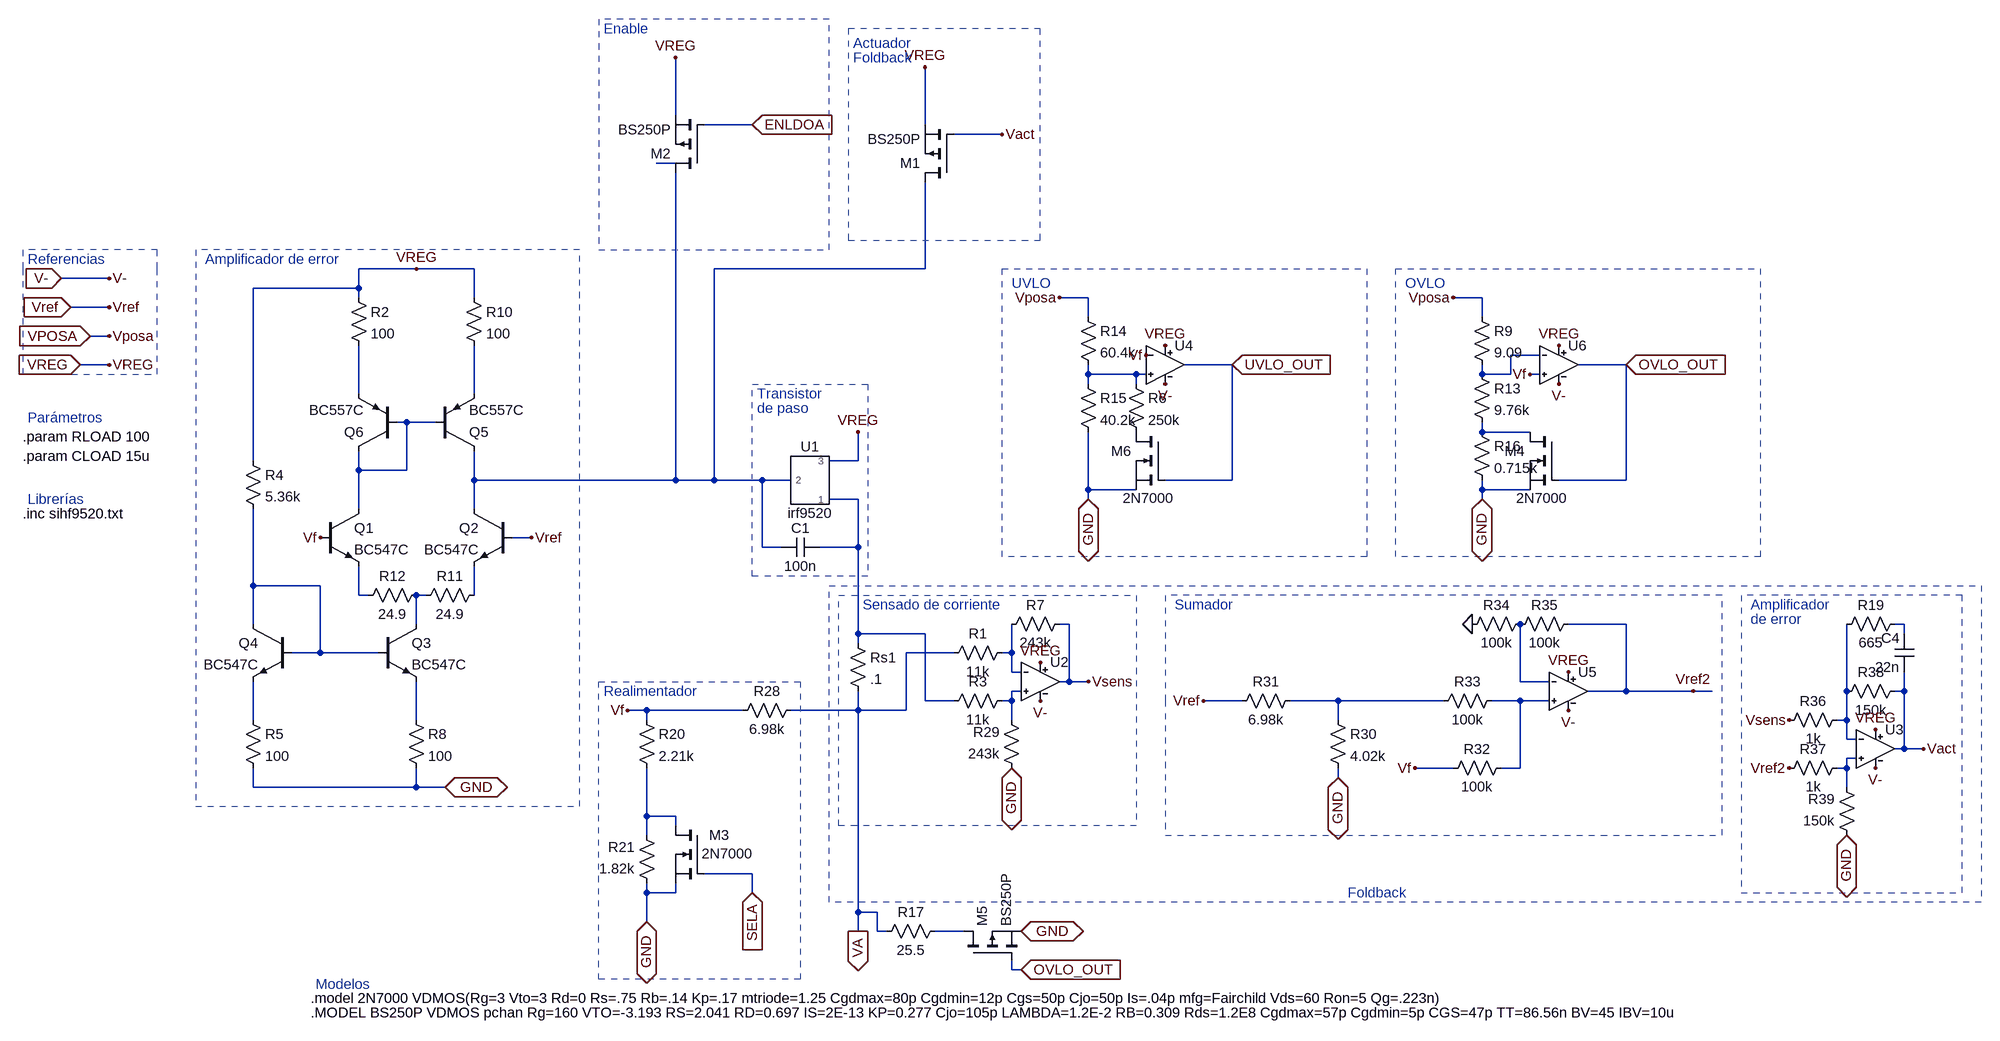
[diagram p0: schematic LDOA.asc]
LDOA.asc, the LTspice schematic file:
Version 4
SHEET 1 26844 1652
WIRE 288 -704 288 -800
WIRE 416 -688 336 -688
WIRE 704 -688 704 -784
WIRE 832 -672 752 -672
WIRE 288 -624 256 -624
WIRE -144 -448 -240 -448
WIRE -48 -448 -144 -448
WIRE 704 -448 704 -592
WIRE 704 -448 352 -448
WIRE -656 -432 -736 -432
WIRE -240 -416 -240 -448
WIRE -240 -416 -416 -416
WIRE -240 -400 -240 -416
WIRE -48 -400 -48 -448
WIRE 976 -400 928 -400
WIRE 1632 -400 1584 -400
WIRE -656 -384 -720 -384
WIRE 976 -368 976 -400
WIRE 1632 -368 1632 -400
WIRE -656 -336 -688 -336
WIRE 1728 -304 1680 -304
WIRE -656 -288 -704 -288
WIRE 1216 -288 1136 -288
WIRE 1872 -288 1792 -288
WIRE 976 -272 976 -288
WIRE 1056 -272 976 -272
WIRE 1072 -272 1056 -272
WIRE 1632 -272 1632 -288
WIRE 1680 -272 1680 -304
WIRE 1680 -272 1632 -272
WIRE 1728 -272 1712 -272
WIRE 976 -256 976 -272
WIRE 1056 -256 1056 -272
WIRE -240 -240 -240 -320
WIRE -48 -240 -48 -320
WIRE -160 -192 -176 -192
WIRE -112 -192 -160 -192
WIRE 1632 -176 1632 -192
WIRE 1712 -176 1632 -176
WIRE -416 -128 -416 -416
WIRE 592 -128 592 -176
WIRE 592 -128 544 -128
WIRE -240 -112 -240 -144
WIRE -160 -112 -160 -192
WIRE -160 -112 -240 -112
WIRE -48 -96 -48 -144
WIRE 288 -96 288 -608
WIRE 288 -96 -48 -96
WIRE 352 -96 352 -448
WIRE 352 -96 288 -96
WIRE 432 -96 352 -96
WIRE 480 -96 432 -96
WIRE 1216 -96 1216 -288
WIRE 1216 -96 1104 -96
WIRE 1872 -96 1872 -288
WIRE 1872 -96 1760 -96
WIRE 976 -80 976 -176
WIRE 1056 -80 976 -80
WIRE 1632 -80 1632 -96
WIRE 1712 -80 1632 -80
WIRE 592 -64 544 -64
WIRE 976 -64 976 -80
WIRE 1632 -64 1632 -80
WIRE -240 -48 -240 -112
WIRE -48 -48 -48 -96
WIRE 48 0 16 0
WIRE 432 16 432 -96
WIRE 464 16 432 16
WIRE 592 16 592 -64
WIRE 592 16 528 16
WIRE -416 80 -416 -48
WIRE -304 80 -416 80
WIRE -240 96 -240 48
WIRE -224 96 -240 96
WIRE -128 96 -144 96
WIRE -48 96 -48 48
WIRE -416 144 -416 80
WIRE -144 144 -144 96
WIRE 944 144 928 144
WIRE 1872 144 1776 144
WIRE 2336 144 2320 144
WIRE 592 160 592 16
WIRE 704 160 592 160
WIRE 2336 160 2336 144
WIRE 592 176 592 160
WIRE -304 192 -304 80
WIRE -304 192 -352 192
WIRE -208 192 -304 192
WIRE 752 192 672 192
WIRE 848 192 848 144
WIRE 848 192 832 192
WIRE 848 224 848 192
WIRE 864 224 848 224
WIRE 944 240 944 144
WIRE 944 240 928 240
WIRE 976 240 944 240
WIRE 1696 240 1696 144
WIRE 1744 240 1696 240
WIRE 864 256 848 256
WIRE 1872 256 1872 144
WIRE 1872 256 1808 256
WIRE 1984 256 1872 256
WIRE 2016 256 1984 256
WIRE 2240 256 2240 144
WIRE 2336 256 2336 224
WIRE 2336 256 2320 256
WIRE 704 272 704 160
WIRE 752 272 704 272
WIRE 848 272 848 256
WIRE 848 272 832 272
WIRE 1232 272 1168 272
WIRE 1392 272 1312 272
WIRE 1568 272 1392 272
WIRE 1696 272 1648 272
WIRE 1744 272 1696 272
WIRE 240 288 208 288
WIRE 400 288 240 288
WIRE 592 288 592 256
WIRE 592 288 480 288
WIRE 672 288 672 192
WIRE 672 288 592 288
WIRE -416 304 -416 240
WIRE -144 304 -144 240
WIRE 240 304 240 288
WIRE 848 304 848 272
WIRE 1392 304 1392 272
WIRE 2240 304 2240 256
WIRE 2240 304 2224 304
WIRE 2240 336 2240 304
WIRE 2256 336 2240 336
WIRE 2336 352 2336 256
WIRE 2336 352 2320 352
WIRE 2368 352 2336 352
WIRE 2256 368 2240 368
WIRE 1584 384 1520 384
WIRE 1696 384 1696 272
WIRE 1696 384 1664 384
WIRE 2240 384 2240 368
WIRE 2240 384 2224 384
WIRE 1392 400 1392 384
WIRE -416 416 -416 384
WIRE -144 416 -144 384
WIRE -144 416 -416 416
WIRE -96 416 -144 416
WIRE 2240 416 2240 384
WIRE 240 464 240 384
WIRE 288 464 240 464
WIRE 288 480 288 464
WIRE 240 496 240 464
WIRE 416 560 336 560
WIRE 240 592 240 576
WIRE 288 592 288 576
WIRE 288 592 240 592
WIRE 416 592 416 560
WIRE 592 624 592 288
WIRE 624 624 592 624
WIRE 240 640 240 592
WIRE 592 656 592 624
WIRE 624 656 624 624
WIRE 640 656 624 656
WIRE 768 656 720 656
WIRE 848 720 848 704
WIRE 864 720 848 720
FLAG 704 -784 VREG
FLAG 832 -672 Vact
FLAG 976 240 Vsens
FLAG 1984 256 Vref2
FLAG 1168 272 Vref
FLAG 1520 384 Vf
FLAG 1616 144 0
FLAG 2368 352 Vact
FLAG 2144 384 Vref2
FLAG 2144 304 Vsens
FLAG 208 288 Vf
FLAG -144 -448 VREG
FLAG -304 0 Vf
FLAG 896 208 VREG
FLAG -656 -432 V-
FLAG 896 272 V-
FLAG 2288 320 VREG
FLAG 2288 384 V-
FLAG 1776 224 VREG
FLAG 1776 288 V-
FLAG 288 -800 VREG
FLAG 416 -688 ENLDOA
IOPIN 416 -688 In
FLAG -704 -288 VREG
IOPIN -704 -288 In
FLAG -736 -432 V-
IOPIN -736 -432 In
FLAG -720 -384 Vref
IOPIN -720 -384 In
FLAG 592 656 VA
IOPIN 592 656 Out
FLAG 416 592 SELA
IOPIN 416 592 In
FLAG 240 640 GND
IOPIN 240 640 BiDir
FLAG 848 384 GND
IOPIN 848 384 BiDir
FLAG 1392 400 GND
IOPIN 1392 400 BiDir
FLAG 2240 496 GND
IOPIN 2240 496 BiDir
FLAG -96 416 GND
IOPIN -96 416 BiDir
FLAG -688 -336 VPOSA
IOPIN -688 -336 In
FLAG -656 -336 Vposa
FLAG -656 -384 Vref
FLAG 48 0 Vref
FLAG -656 -288 VREG
FLAG 592 -176 VREG
FLAG 1104 -320 VREG
FLAG 928 -400 Vposa
FLAG 976 -64 GND
IOPIN 976 -64 BiDir
FLAG 1216 -288 UVLO_OUT
IOPIN 1216 -288 In
FLAG 1104 -256 V-
FLAG 1072 -304 Vf
FLAG 1760 -320 VREG
FLAG 1584 -400 Vposa
FLAG 1632 -64 GND
IOPIN 1632 -64 BiDir
FLAG 1872 -288 OVLO_OUT
IOPIN 1872 -288 In
FLAG 1760 -256 V-
FLAG 1712 -272 Vf
FLAG 864 720 OVLO_OUT
IOPIN 864 720 In
FLAG 864 656 GND
IOPIN 864 656 BiDir
SYMBOL pmos 752 -592 R180
SYMATTR InstName M1
SYMATTR Value BS250P
SYMBOL cap 528 0 R90
WINDOW 0 0 32 VBottom 2
WINDOW 3 32 32 VTop 2
SYMATTR InstName C1
SYMATTR Value 100n
SYMBOL res 2224 160 R270
WINDOW 0 32 56 VTop 2
WINDOW 3 0 56 VBottom 2
SYMATTR InstName R19
SYMATTR Value 665
SYMBOL cap 2352 224 R180
WINDOW 0 24 56 Left 2
WINDOW 3 24 8 Left 2
SYMATTR InstName C4
SYMATTR Value 22n
SYMBOL res 224 288 R0
SYMATTR InstName R20
SYMATTR Value 2.21k
SYMBOL res 256 592 R180
WINDOW 0 36 76 Left 2
WINDOW 3 36 40 Left 2
SYMATTR InstName R21
SYMATTR Value 1.82k
SYMBOL res 496 272 R90
WINDOW 0 0 56 VBottom 2
WINDOW 3 32 56 VTop 2
SYMATTR InstName R28
SYMATTR Value 6.98k
SYMBOL nmos 336 480 M0
WINDOW 0 -42 16 Left 2
WINDOW 3 -80 47 Left 2
SYMATTR InstName M3
SYMATTR Value 2N7000
SYMBOL res 576 160 R0
SYMATTR InstName Rs1
SYMATTR Value .1
SYMBOL res 848 176 R90
WINDOW 0 0 56 VBottom 2
WINDOW 3 32 56 VTop 2
SYMATTR InstName R1
SYMATTR Value 11k
SYMBOL res 848 256 R90
WINDOW 0 0 56 VBottom 2
WINDOW 3 32 56 VTop 2
SYMATTR InstName R3
SYMATTR Value 11k
SYMBOL res 944 128 R90
WINDOW 0 0 56 VBottom 2
WINDOW 3 32 56 VTop 2
SYMATTR InstName R7
SYMATTR Value 243k
SYMBOL res 864 400 R180
WINDOW 0 36 76 Left 2
WINDOW 3 36 40 Left 2
SYMATTR InstName R29
SYMATTR Value 243k
SYMBOL res 1376 288 R0
SYMATTR InstName R30
SYMATTR Value 4.02k
SYMBOL res 1328 256 R90
WINDOW 0 0 56 VBottom 2
WINDOW 3 32 56 VTop 2
SYMATTR InstName R31
SYMATTR Value 6.98k
SYMBOL res 1680 368 R90
WINDOW 0 0 56 VBottom 2
WINDOW 3 32 56 VTop 2
SYMATTR InstName R32
SYMATTR Value 100k
SYMBOL res 1664 256 R90
WINDOW 0 0 56 VBottom 2
WINDOW 3 32 56 VTop 2
SYMATTR InstName R33
SYMATTR Value 100k
SYMBOL res 1712 128 R90
WINDOW 0 0 56 VBottom 2
WINDOW 3 32 56 VTop 2
SYMATTR InstName R34
SYMATTR Value 100k
SYMBOL res 1792 128 R90
WINDOW 0 0 56 VBottom 2
WINDOW 3 32 56 VTop 2
SYMATTR InstName R35
SYMATTR Value 100k
SYMBOL res 2240 288 R90
WINDOW 0 0 56 VBottom 2
WINDOW 3 32 56 VTop 2
SYMATTR InstName R36
SYMATTR Value 1k
SYMBOL res 2240 368 R90
WINDOW 0 0 56 VBottom 2
WINDOW 3 32 56 VTop 2
SYMATTR InstName R37
SYMATTR Value 1k
SYMBOL res 2336 240 R90
WINDOW 0 0 56 VBottom 2
WINDOW 3 32 56 VTop 2
SYMATTR InstName R38
SYMATTR Value 150k
SYMBOL res 2256 512 R180
WINDOW 0 36 76 Left 2
WINDOW 3 36 40 Left 2
SYMATTR InstName R39
SYMATTR Value 150k
SYMBOL npn -304 -48 R0
SYMATTR InstName Q1
SYMATTR Value BC547C
SYMBOL npn 16 -48 M0
SYMATTR InstName Q2
SYMATTR Value BC547C
SYMBOL res -256 -416 R0
SYMATTR InstName R2
SYMATTR Value 100
SYMBOL npn -208 144 R0
SYMATTR InstName Q3
SYMATTR Value BC547C
SYMBOL npn -352 144 M0
SYMATTR InstName Q4
SYMATTR Value BC547C
SYMBOL res -432 -144 R0
SYMATTR InstName R4
SYMATTR Value 5.36k
SYMBOL res -432 288 R0
SYMATTR InstName R5
SYMATTR Value 100
SYMBOL res -160 288 R0
SYMATTR InstName R8
SYMATTR Value 100
SYMBOL res -64 -416 R0
SYMATTR InstName R10
SYMATTR Value 100
SYMBOL pnp -112 -144 M180
SYMATTR InstName Q5
SYMATTR Value BC557C
SYMBOL pnp -176 -144 R180
SYMATTR InstName Q6
SYMATTR Value BC557C
SYMBOL res -32 80 R90
WINDOW 0 0 56 VBottom 2
WINDOW 3 32 56 VTop 2
SYMATTR InstName R11
SYMATTR Value 24.9
SYMBOL res -128 80 R90
WINDOW 0 0 56 VBottom 2
WINDOW 3 32 56 VTop 2
SYMATTR InstName R12
SYMATTR Value 24.9
SYMBOL TL081 896 240 R0
SYMATTR InstName U2
SYMBOL TL081 2288 352 R0
SYMATTR InstName U3
SYMBOL TL081 1776 256 R0
SYMATTR InstName U5
SYMBOL pmos 336 -608 R180
SYMATTR InstName M2
SYMATTR Value BS250P
SYMBOL res 960 -384 R0
SYMATTR InstName R14
SYMATTR Value 60.4k
SYMBOL res 960 -272 R0
SYMATTR InstName R15
SYMATTR Value 40.2k
SYMBOL nmos 1104 -176 M0
WINDOW 3 -14 110 Left 2
SYMATTR Value 2N7000
SYMATTR InstName M6
SYMBOL TL081 1104 -288 R0
SYMATTR InstName U4
SYMBOL res 1040 -272 R0
SYMATTR InstName R6
SYMATTR Value 250k
SYMBOL res 1616 -384 R0
SYMATTR InstName R9
SYMATTR Value 9.09
SYMBOL res 1616 -288 R0
SYMATTR InstName R13
SYMATTR Value 9.76k
SYMBOL nmos 1760 -176 M0
WINDOW 3 -14 110 Left 2
SYMATTR Value 2N7000
SYMATTR InstName M4
SYMBOL TL081 1760 -288 R0
SYMATTR InstName U6
SYMBOL res 1616 -192 R0
SYMATTR InstName R16
SYMATTR Value 0.715k
SYMBOL res 736 640 R90
WINDOW 0 0 56 VBottom 2
WINDOW 3 32 56 VTop 2
SYMATTR InstName R17
SYMATTR Value 25.5
SYMBOL pmos 768 704 R270
SYMATTR InstName M5
SYMATTR Value BS250P
SYMBOL irf9520 512 -96 R0
SYMATTR InstName U1
TEXT -800 -168 Left 2 !.param RLOAD 100
TEXT -800 -40 Left 2 !.inc sihf9520.txt
TEXT -320 768 Left 2 !.model 2N7000 VDMOS(Rg=3 Vto=3 Rd=0 Rs=.75 Rb=.14 Kp=.17 mtriode=1.25 Cgdmax=80p Cgdmin=12p Cgs=50p Cjo=50p Is=.04p mfg=Fairchild Vds=60 Ron=5 Qg=.223n)
TEXT -800 -136 Left 2 !.param CLOAD 15u
TEXT -792 -464 Left 2 ;Referencias
TEXT -496 -464 Left 2 ;Amplificador de error
TEXT 168 -848 Left 2 ;Enable
TEXT 584 -824 Left 2 ;Actuador
TEXT 424 -240 Left 2 ;Transistor
TEXT 424 -216 Left 2 ;de paso
TEXT 168 256 Left 2 ;Realimentador
TEXT 600 112 Left 2 ;Sensado de corriente
TEXT 1120 112 Left 2 ;Sumador
TEXT 2080 112 Left 2 ;Amplificador
TEXT 2080 136 Left 2 ;de error
TEXT -312 744 Left 2 ;Modelos
TEXT -792 -200 Left 2 ;Parámetros
TEXT -792 -64 Left 2 ;Librerías
TEXT 1408 592 Left 2 ;Foldback
TEXT 584 -800 Left 2 ;Foldback
TEXT 848 -424 Left 2 ;UVLO
TEXT 1504 -424 Left 2 ;OVLO
TEXT -320 792 Left 2 !.MODEL BS250P VDMOS pchan Rg=160 VTO=-3.193 RS=2.041 RD=0.697 IS=2E-13 KP=0.277 Cjo=105p LAMBDA=1.2E-2 RB=0.309 Rds=1.2E8 Cgdmax=57p Cgdmin=5p CGS=47p TT=86.56n BV=45 IBV=10u
LINE Normal -576 -480 -800 -480 2
LINE Normal -576 -272 -576 -448 2
LINE Normal -800 -272 -576 -272 2
LINE Normal -800 -448 -800 -272 2
LINE Normal 128 -480 -512 -480 3
LINE Normal 128 448 128 -480 3
LINE Normal -512 448 128 448 3
LINE Normal -512 -480 -512 448 3
LINE Normal 160 -864 160 -480 1
LINE Normal 544 -864 160 -864 1
LINE Normal 544 -480 544 -864 1
LINE Normal 160 -480 544 -480 1
LINE Normal 896 -848 576 -848 1
LINE Normal 896 -496 896 -848 1
LINE Normal 576 -496 896 -496 1
LINE Normal 576 -848 576 -496 1
LINE Normal -800 -480 -800 -448 2
LINE Normal -576 -448 -576 -480 2
LINE Normal 608 64 416 64 1
LINE Normal 608 -256 608 64 1
LINE Normal 416 -256 608 -256 1
LINE Normal 416 64 416 -256 1
LINE Normal 160 240 496 240 1
LINE Normal 160 736 160 240 1
LINE Normal 496 736 160 736 1
LINE Normal 496 240 496 736 1
LINE Normal 560 96 896 96 1
LINE Normal 560 480 560 96 1
LINE Normal 1056 480 560 480 1
LINE Normal 1056 96 1056 480 1
LINE Normal 896 96 1056 96 1
LINE Normal 1104 96 1104 272 1
LINE Normal 2032 96 1104 96 1
LINE Normal 2032 496 2032 96 1
LINE Normal 1104 496 2032 496 1
LINE Normal 1104 272 1104 496 1
LINE Normal 2064 96 2064 304 3
LINE Normal 2432 96 2064 96 3
LINE Normal 2432 592 2432 96 3
LINE Normal 2064 592 2432 592 3
LINE Normal 2064 304 2064 592 3
LINE Normal 544 608 544 80 4
LINE Normal 2464 608 544 608 4
LINE Normal 2464 80 2464 608 4
LINE Normal 544 80 2464 80 4
LINE Normal 832 32 832 -448 1
LINE Normal 1440 32 832 32 1
LINE Normal 1440 -448 1440 32 1
LINE Normal 832 -448 1440 -448 1
LINE Normal 1488 32 1488 -448 1
LINE Normal 2096 32 1488 32 1
LINE Normal 2096 -448 2096 32 1
LINE Normal 1488 -448 2096 -448 1

The netlist it stands for:
* LDOA.asc
M1 N002 Vact VREG VREG BS250P
C1 N009 N002 100n
R19 N018 N014 665
C4 Vact N014 22n
R20 Vf N024 2.21k
R21 GND N024 1.82k
R28 VA Vf 6.98k
M3 N024 SELA GND GND 2N7000
Rs1 N009 VA .1
R1 N015 VA 11k
R3 N017 N009 11k
R7 Vsens N015 243k
R29 GND N017 243k
R30 N019 GND 4.02k
R31 N019 Vref 6.98k
R32 N020 Vf 100k
R33 N020 N019 100k
R34 N016 0 100k
R35 Vref2 N016 100k
R36 N018 Vsens 1k
R37 N023 Vref2 1k
R38 Vact N018 150k
R39 GND N023 150k
Q1 N007 Vf N011 0 BC547C
Q2 N002 Vref N013 0 BC547C
R2 VREG N005 100
Q3 N012 N010 N022 0 BC547C
Q4 N010 N010 N021 0 BC547C
R4 VREG N010 5.36k
R5 N021 GND 100
R8 N022 GND 100
R10 VREG N006 100
Q5 N002 N007 N006 0 BC557C
Q6 N007 N007 N005 0 BC557C
R11 N013 N012 24.9
R12 N012 N011 24.9
XU2 N017 N015 VREG V- Vsens TL081  ; pins In+ In- V+ V- OUT
XU3 N023 N018 VREG V- Vact TL081  ; pins In+ In- V+ V- OUT
XU5 N020 N016 VREG V- Vref2 TL081  ; pins In+ In- V+ V- OUT
M2 N002 ENLDOA VREG VREG BS250P
R14 VPOSA N004 60.4k
R15 N004 GND 40.2k
M6 P001 UVLO_OUT GND GND 2N7000
XU4 N004 Vf VREG V- UVLO_OUT TL081  ; pins In+ In- V+ V- OUT
R6 N004 P001 250k
R9 VPOSA N003 9.09
R13 N003 N008 9.76k
M4 N008 OVLO_OUT GND GND 2N7000
XU6 Vf N003 VREG V- OVLO_OUT TL081  ; pins In+ In- V+ V- OUT
R16 N008 GND 0.715k
R17 N025 VA 25.5
M5 N025 OVLO_OUT GND GND BS250P
XU1 N009 N002 VREG irf9520  ; pins 1 2 3
.model NPN NPN
.model PNP PNP
.lib standard.bjt
.model NMOS NMOS
.model PMOS PMOS
.lib standard.mos
.param RLOAD 100
.inc sihf9520.txt
.model 2N7000 VDMOS(Rg=3 Vto=3 Rd=0 Rs=.75 Rb=.14 Kp=.17 mtriode=1.25 Cgdmax=80p Cgdmin=12p Cgs=50p Cjo=50p Is=.04p mfg=Fairchild Vds=60 Ron=5 Qg=.223n)
.param CLOAD 15u
* Referencias
* Amplificador de error
* Enable
* Actuador
* Transistor
* de paso
* Realimentador
* Sensado de corriente
* Sumador
* Amplificador
* de error
* Modelos
* Parámetros
* Librerías
* Foldback
* Foldback
* UVLO
* OVLO
.MODEL BS250P VDMOS pchan Rg=160 VTO=-3.193 RS=2.041 RD=0.697 IS=2E-13 KP=0.277 Cjo=105p LAMBDA=1.2E-2 RB=0.309 Rds=1.2E8 Cgdmax=57p Cgdmin=5p CGS=47p TT=86.56n BV=45 IBV=10u
.lib TL081.301
.lib sihf9520.txt
.backanno
.end